# EAGLE design plytka_glowna (EAGLE 7.6.0)
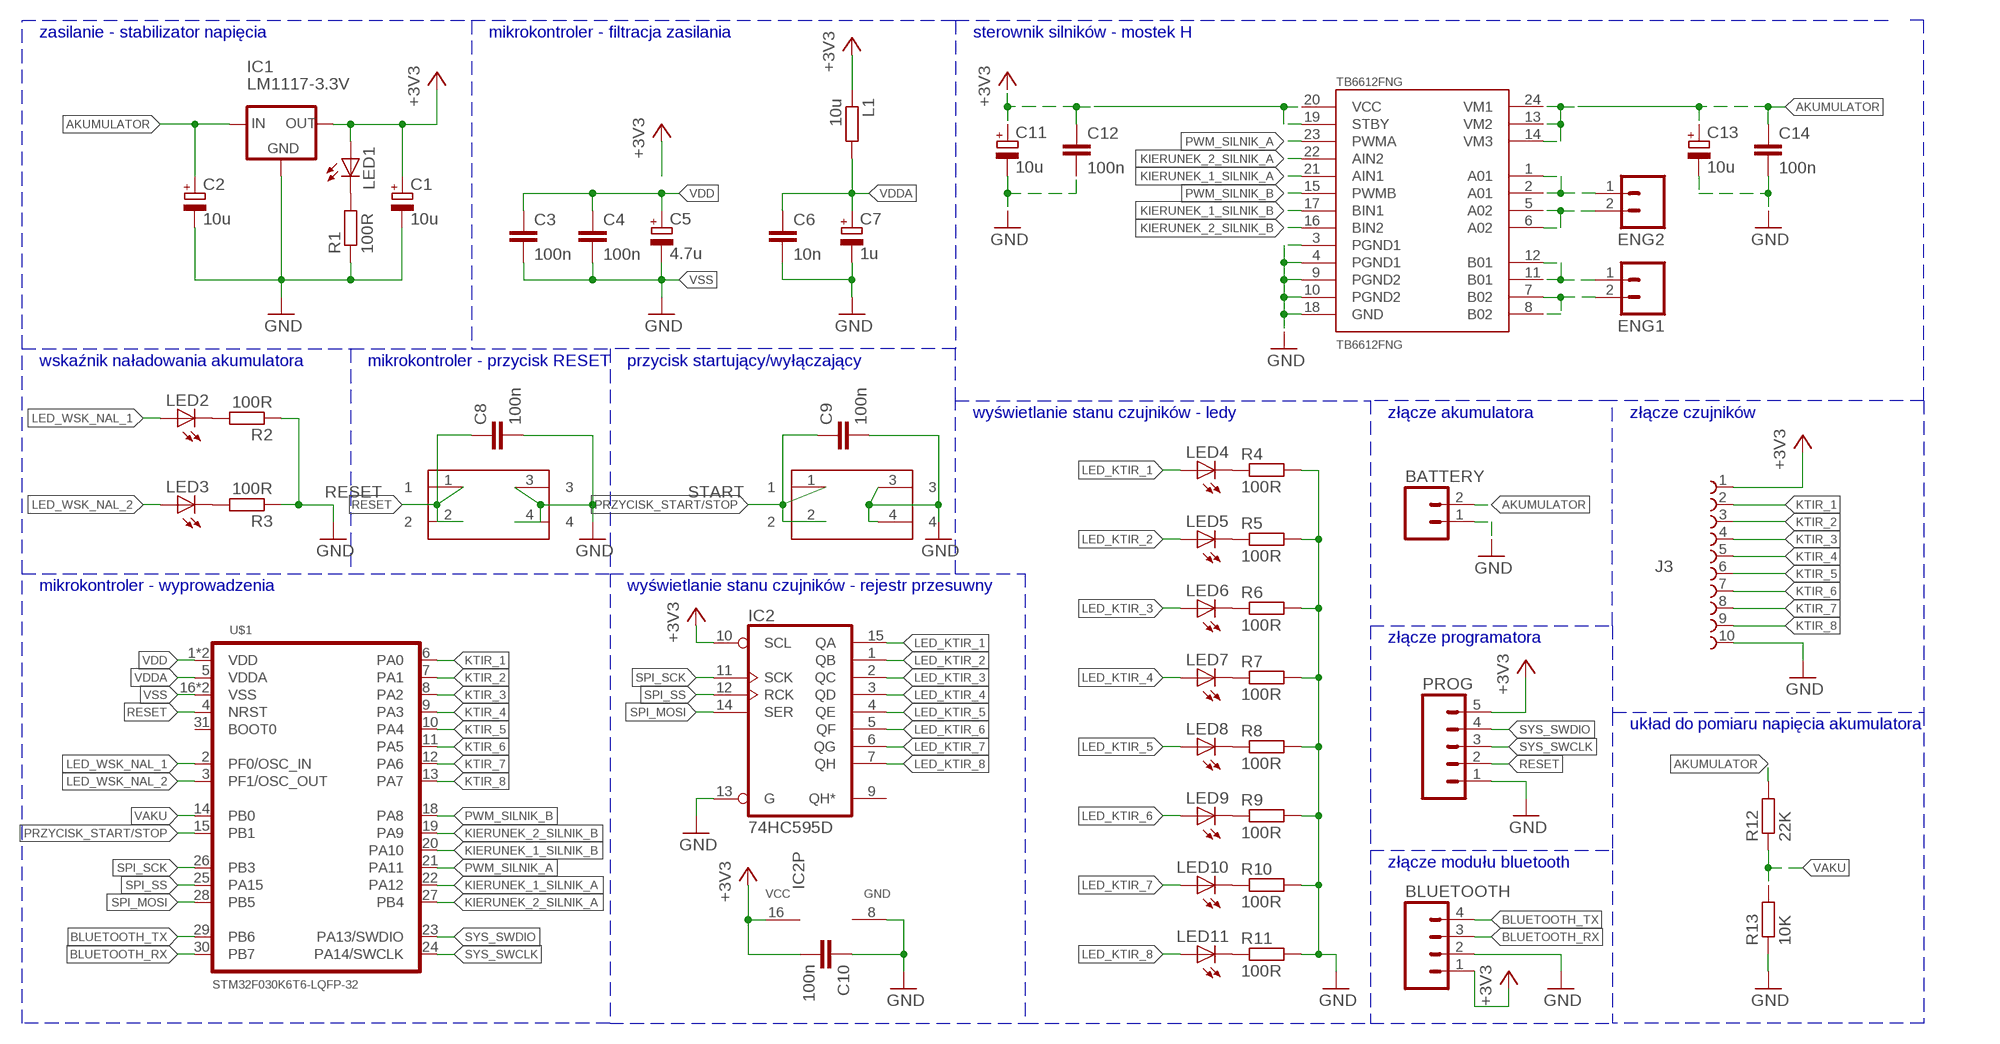
[diagram p0: schematic, sheet 1]

## Parts
BATTERY  M02-JST-2-PTH-NO_SILK  [JST-2-PTH-NS]
BLUETOOTH  M04JST  [1X04-1.5MM_JST]
C1  10u  CPOL-EUUD-4X5,8  [UD-4X5,8_NICHICON]
C2  10u  CPOL-EUUD-4X5,8  [UD-4X5,8_NICHICON]
C3  100n  C-EUC0805  [C0805]
C4  100n  C-EUC0805  [C0805]
C5  4.7u  CPOL-EUSMCA  [SMC_A]
C6  10n  C-EUC0805  [C0805]
C7  1u  CPOL-EUSMCA  [SMC_A]
C8  100n  C-EUC0805  [C0805]
C9  100n  C-EUC0805  [C0805]
C10  100n  C-EUC0805  [C0805]
C11  10u  CPOL-EUUD-4X5,8  [UD-4X5,8_NICHICON]
C12  100n  C-EUC0805  [C0805]
C13  10u  CPOL-EUUD-4X5,8  [UD-4X5,8_NICHICON]
C14  100n  C-EUC0805  [C0805]
ENG1  M02-JST-2-PTH-NO_SILK  [JST-2-PTH-NS]
ENG2  M02-JST-2-PTH-NO_SILK  [JST-2-PTH-NS]
IC1  LM1117-3.3V  LM1117DTX-3.3  [TO252]
IC2  74HC595D  [SO16]
J3  68611014422  [68611014422]
L1  10u  R-EU_R0805  [R0805]
LED1  LEDCHIP-LED0805  [CHIP-LED0805]
LED2  LEDCHIP-LED0805  [CHIP-LED0805]
LED3  LEDCHIP-LED0805  [CHIP-LED0805]
LED4  LEDCHIP-LED0805  [CHIP-LED0805]
LED5  LEDCHIP-LED0805  [CHIP-LED0805]
LED6  LEDCHIP-LED0805  [CHIP-LED0805]
LED7  LEDCHIP-LED0805  [CHIP-LED0805]
LED8  LEDCHIP-LED0805  [CHIP-LED0805]
LED9  LEDCHIP-LED0805  [CHIP-LED0805]
LED10  LEDCHIP-LED0805  [CHIP-LED0805]
LED11  LEDCHIP-LED0805  [CHIP-LED0805]
PROG  M05LOCK_LONGPADS  [1X05_LOCK_LONGPADS]
R1  100R  R-EU_M0805  [M0805]
R2  100R  R-EU_M0805  [M0805]
R3  100R  R-EU_M0805  [M0805]
R4  100R  R-EU_M0805  [M0805]
R5  100R  R-EU_M0805  [M0805]
R6  100R  R-EU_M0805  [M0805]
R7  100R  R-EU_M0805  [M0805]
R8  100R  R-EU_M0805  [M0805]
R9  100R  R-EU_M0805  [M0805]
R10  100R  R-EU_M0805  [M0805]
R11  100R  R-EU_M0805  [M0805]
R12  22K  R-EU_M0805  [M0805]
R13  10K  R-EU_M0805  [M0805]
RESET  430186043916  [430186043916]
START  430186043916  [430186043916]
TB6612FNG  TB6612FNG  [SSOP24]
U$1  STM32F030K6T6-LQFP-32  [LQFP-32]

## Nets
+3V3: BLUETOOTH.1 C1.+ C10.2 IC1.TAB(OUT) IC2.10(SCL) IC2.16(VCC) J3.1 L1.1 LED1.A PROG.5
AKUMULATOR: BATTERY.2 C2.+ C13.+ C14.1 IC1.2(IN) R12.2 TB6612FNG.13(VM2) TB6612FNG.14(VM3) TB6612FNG.24(VM1)
BLUETOOTH_RX: BLUETOOTH.3 U$1.30(PB7)
BLUETOOTH_TX: BLUETOOTH.4 U$1.29(PB6)
GND: BATTERY.1 BLUETOOTH.2 C1.- C2.- C6.2 C7.- C8.2 C9.2 C10.1 C11.- C12.2 C13.- C14.2 IC1.1(GND) IC2.8(GND) IC2.13(G) J3.10 PROG.1 R1.1 R2.1 R3.1 R4.2 R5.2 R6.2 R7.2 R8.2 R9.2 R10.2 R11.2 R13.1 RESET.3 RESET.4 START.3 START.4 TB6612FNG.3(PGND1) TB6612FNG.4(PGND1) TB6612FNG.9(PGND2) TB6612FNG.10(PGND2) TB6612FNG.18(GND)
KIERUNEK_1_SILNIK_A: TB6612FNG.21(AIN1) U$1.22(PA12)
KIERUNEK_1_SILNIK_B: TB6612FNG.17(BIN1) U$1.20(PA10)
KIERUNEK_2_SILNIK_A: TB6612FNG.22(AIN2) U$1.27(PB4)
KIERUNEK_2_SILNIK_B: TB6612FNG.16(BIN2) U$1.19(PA9)
KTIR_1: J3.2 U$1.6(PA0)
KTIR_2: J3.3 U$1.7(PA1)
KTIR_3: J3.4 U$1.8(PA2)
KTIR_4: J3.5 U$1.9(PA3)
KTIR_5: J3.6 U$1.10(PA4)
KTIR_6: J3.7 U$1.11(PA5)
KTIR_7: J3.8 U$1.12(PA6)
KTIR_8: J3.9 U$1.13(PA7)
LED_KTIR_1: IC2.15(QA) LED4.A
LED_KTIR_2: IC2.1(QB) LED5.A
LED_KTIR_3: IC2.2(QC) LED6.A
LED_KTIR_4: IC2.3(QD) LED7.A
LED_KTIR_5: IC2.4(QE) LED8.A
LED_KTIR_6: IC2.5(QF) LED9.A
LED_KTIR_7: IC2.6(QG) LED10.A
LED_KTIR_8: IC2.7(QH) LED11.A
LED_WSK_NAL_1: LED2.A U$1.2(PF0/OSC_IN)
LED_WSK_NAL_2: LED3.A U$1.3(PF1/OSC_OUT)
N$1: LED1.C R1.2
N$2: LED2.C R2.2
N$3: LED3.C R3.2
N$4: LED4.C R4.1
N$5: LED5.C R5.1
N$6: ENG2.2 TB6612FNG.5(A02) TB6612FNG.6(A02)
N$7: ENG1.2 TB6612FNG.7(B02) TB6612FNG.8(B02)
N$8: LED6.C R6.1
N$9: ENG1.1 TB6612FNG.11(B01) TB6612FNG.12(B01)
N$10: LED7.C R7.1
N$11: ENG2.1 TB6612FNG.1(A01) TB6612FNG.2(A01)
N$12: LED8.C R8.1
N$14: LED9.C R9.1
N$16: LED10.C R10.1
N$18: LED11.C R11.1
PRZYCISK_START/STOP: C9.1 START.1 START.2 U$1.15(PB1)
PWM_SILNIK_A: TB6612FNG.23(PWMA) U$1.21(PA11)
PWM_SILNIK_B: TB6612FNG.15(PWMB) U$1.18(PA8)
RESET: C8.1 PROG.2 RESET.1 RESET.2 U$1.4(NRST)
SPI_MOSI: IC2.14(SER) U$1.28(PB5)
SPI_SCK: IC2.11(SCK) U$1.26(PB3)
SPI_SS: IC2.12(RCK) U$1.25(PA15)
SYS_SWCLK: PROG.3 U$1.24(PA14/SWCLK)
SYS_SWDIO: PROG.4 U$1.23(PA13/SWDIO)
TB6612_VCC: C11.+ C12.1 TB6612FNG.19(STBY) TB6612FNG.20(VCC) ; supply symbol labelled +3V3
VAKU: R12.1 R13.2 U$1.14(PB0)
VDD: C3.1 C4.1 C5.+ U$1.1(VDD) U$1.17(VDD)
VDDA: C6.1 C7.+ L1.2 U$1.5(VDDA)
VSS: C3.2 C4.2 C5.- U$1.16(VSS) U$1.32(VSS) ; supply symbol labelled GND
Unconnected: IC2.9(QH*) U$1.31(BOOT0)

## Buses
B$1

## Notes on the sheet
- zasilanie - stabilizator napięcia | mikrokontroler - filtracja zasilania | sterownik silników - mostek H
- wskaźnik naładowania akumulatora | mikrokontroler - przycisk RESET | przycisk startujący/wyłączający
- wyświetlanie stanu czujników - ledy | złącze akumulatora | złącze czujników
- mikrokontroler - wyprowadzenia | wyświetlanie stanu czujników - rejestr przesuwny
- złącze programatora
- układ do pomiaru napięcia akumulatora
- złącze modułu bluetooth

## Library data of the parts
BATTERY ENG1 ENG2 = SparkFun-Connectors:M02: Standard 2-pin 0.1" header. Use with - straight break away headers ( PRT-00116) - right angle break away headers (PRT-00553) - swiss pins (PRT-00743) - machine pins (PRT-00117) - female headers (PRT-00115) Molex polarized connector foot print use with: PRT-08233 with associated crimp pins and housings. 2.54_SCREWTERM for use with PRT-10571. 3.5mm Screw Terminal footprints for PRT-08084 5mm Screw Terminal footprints for use with PRT-08432
BLUETOOTH = SparkFun-Connectors:M04: Header 4 Standard 4-pin 0.1" header. Use with straight break away headers (SKU : PRT-00116), right angle break away headers (PRT-00553), swiss pins (PRT-00743), machine pins (PRT-00117), and female headers (PRT-00115). Molex polarized connector foot print use with SKU : PRT-08231 with associated crimp pins and housings. 1MM SMD Version SKU: PRT-10208; PROD_ID: CONN-12477
C1 C2 C5 C7 C11 C13 = rcl:CPOL-EU: POLARIZED CAPACITOR, European symbol
C3 C4 C6 C8-C10 C12 C14 = rcl:C-EU: CAPACITOR, European symbol
IC1 = lm1117:LM1117DTX-*
IC2 = 74xx-eu:74*595: 8-bit SHIFT REGISTER, output latch
J3 = FPC_Connectors_Flat_Flexible_Cable_rev15c:68611014422: WR-FPC 1.00mm SMT ZIF Horizontal Bottom Contact, 10 Pins=>Code : Con_FPC_ZIF_1.00_68611014422 <http://katalog.we-online.de/media/images/eican/Con_FPC_ZIF_1.00_6861xx14422_pf2.jpg> Details see: http://katalog.we-online.de/en/em/686_1xx_144_22 Created 2014-07-09, Karrer Zheng 2014 (C) Würth Elektronik
L1 R1-R13 = rcl:R-EU_: RESISTOR, European symbol
LED1-LED11 = led:LED: LED OSRAM: - CHIPLED LG R971, LG N971, LY N971, LG Q971, LY Q971, LO R971, LY R971 LH N974, LH R974 LS Q976, LO Q976, LY Q976 LO Q996 - Hyper CHIPLED LW Q18S LB Q993, LB Q99A, LB R99A - SideLED LS A670, LO A670, LY A670, LG A670, LP A670 LB A673, LV A673, LT A673, LW A673 LH A674 LY A675 LS A676, LA A676, LO A676, LY A676, LW A676 LS A679, LY A679, LG A679 - Hyper Micro SIDELED® LS Y876, LA Y876, LO Y876, LY Y876 LT Y87S - SmartLED LW L88C, LW L88S LB L89C, LB L89S, LG L890 LS L89K, LO L89K, LY L89K LS L896, LA L896, LO L896, LY L896 - TOPLED LS T670, LO T670, LY T670, LG T670, LP T670 LSG T670, LSP T670, LSY T670, LOP T670, LYG T670 LG T671, LOG T671, LSG T671 LB T673, LV T673, LT T673, LW T673 LH T674 LS T676, LA T676, LO T676, LY T676, LB T676, LH T676, LSB T676, LW T676 LB T67C, LV T67C, LT T67C, LS T67K, LO T67K, LY T67K, LW E67C LS E67B, LA E67B, LO E67B, LY E67B, LB E67C, LV E67C, LT E67C LW T67C LS T679, LY T679, LG T679 LS T770, LO T770, LY T770, LG T770, LP T770 LB T773, LV T773, LT T773, LW T773 LH T774 LS E675, LA E675, LY E675, LS T675 LS T776, LA T776, LO T776, LY T776, LB T776 LHGB T686 LT T68C, LB T68C - Hyper Mini TOPLED® LB M676 - Mini TOPLED Santana® LG M470 LS M47K, LO M47K, LY M47K Source: http://www.osram.convergy.de LUXEON: - LUMILED® LXK2-PW12-R00, LXK2-PW12-S00, LXK2-PW14-U00, LXK2-PW14-V00 LXK2-PM12-R00, LXK2-PM12-S00, LXK2-PM14-U00 LXK2-PE12-Q00, LXK2-PE12-R00, LXK2-PE12-S00, LXK2-PE14-T00, LXK2-PE14-U00 LXK2-PB12-K00, LXK2-PB12-L00, LXK2-PB12-M00, LXK2-PB14-N00, LXK2-PB14-P00, LXK2-PB14-Q00 LXK2-PR12-L00, LXK2-PR12-M00, LXK2-PR14-Q00, LXK2-PR14-R00 LXK2-PD12-Q00, LXK2-PD12-R00, LXK2-PD12-S00 LXK2-PH12-R00, LXK2-PH12-S00 LXK2-PL12-P00, LXK2-PL12-Q00, LXK2-PL12-R00 Source: www.luxeon.com KINGBRIGHT: KA-3528ASYC Source: www.kingbright.com
PROG = SparkFun-Connectors:M05: Header 5 Standard 5-pin 0.1" header. Use with straight break away headers (SKU : PRT-00116), right angle break away headers (PRT-00553), swiss pins (PRT-00743), machine pins (PRT-00117), and female headers (PRT-00115). Molex polarized connector foot print use with SKU : PRT-08230 with associated crimp pins and housings.
RESET START = Switches_rev16a:430186043916: WS-TST-6x6 mm THT Tact Switch,4 pins
TB6612FNG = SparkFun-PowerIC:TB6612FNG: Toshiba 1A dual motor driver IC-09363; PROD_ID: IC-09363
U$1 = STM32F030K6T6:STM32F030K6T6

## Board
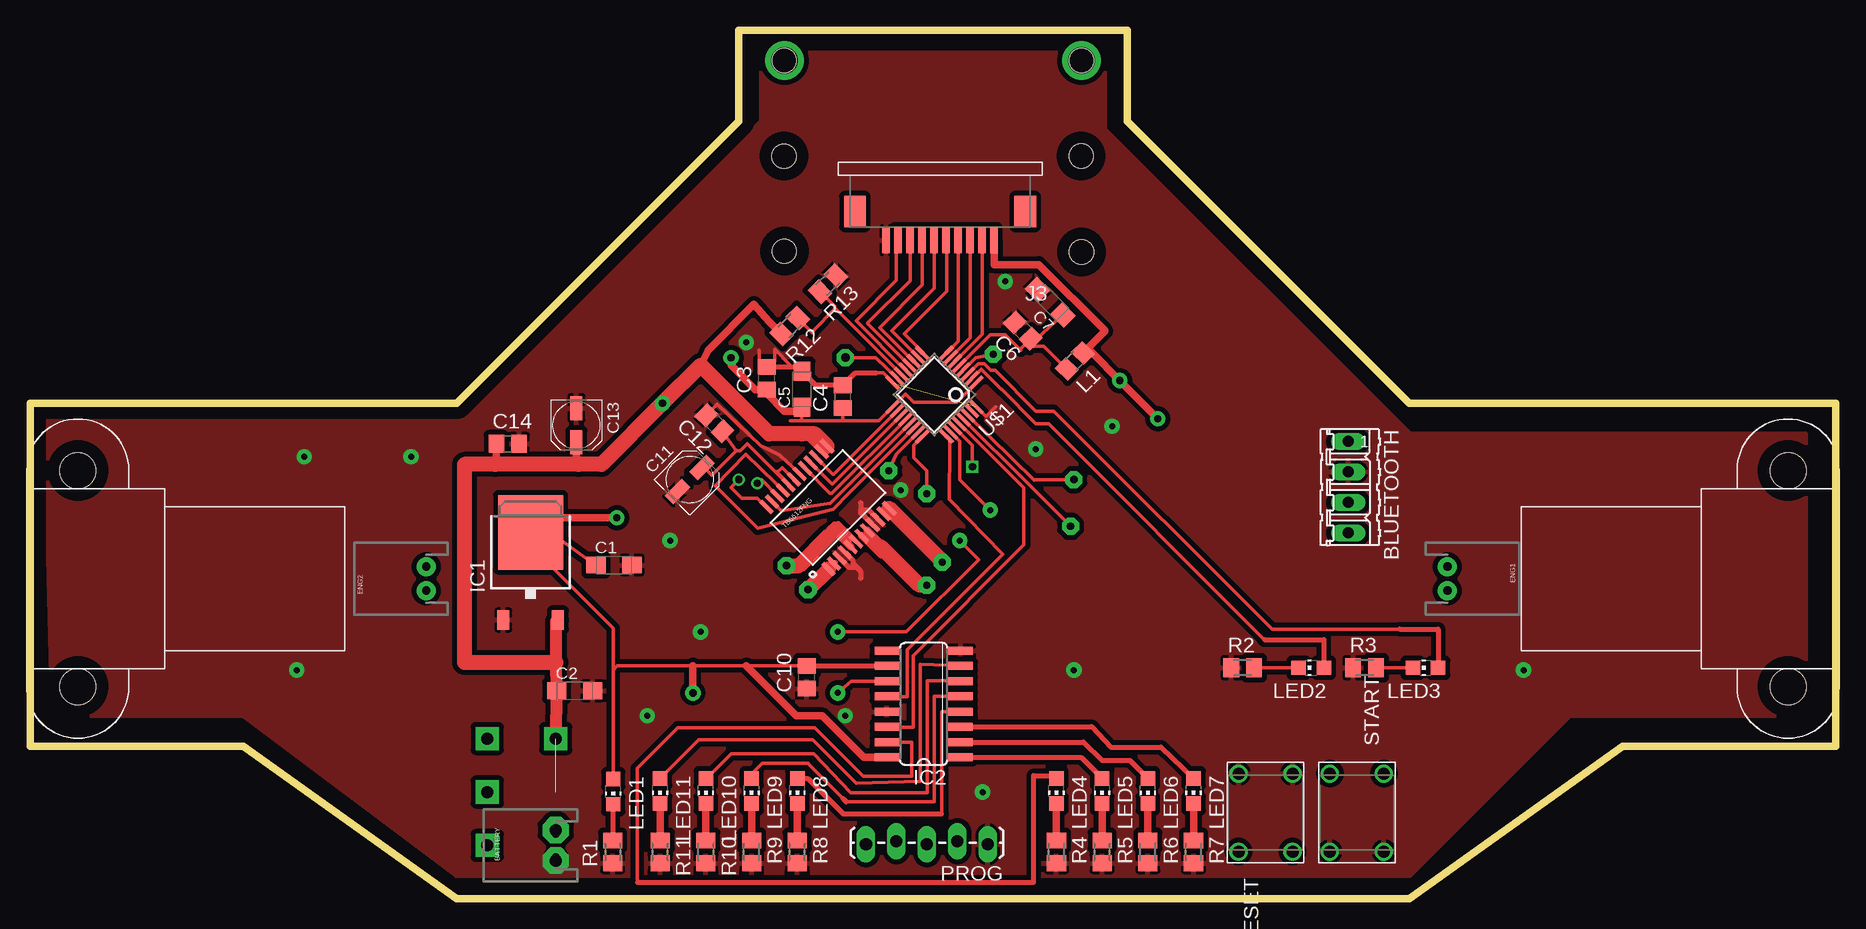
[diagram p1: board, top side]
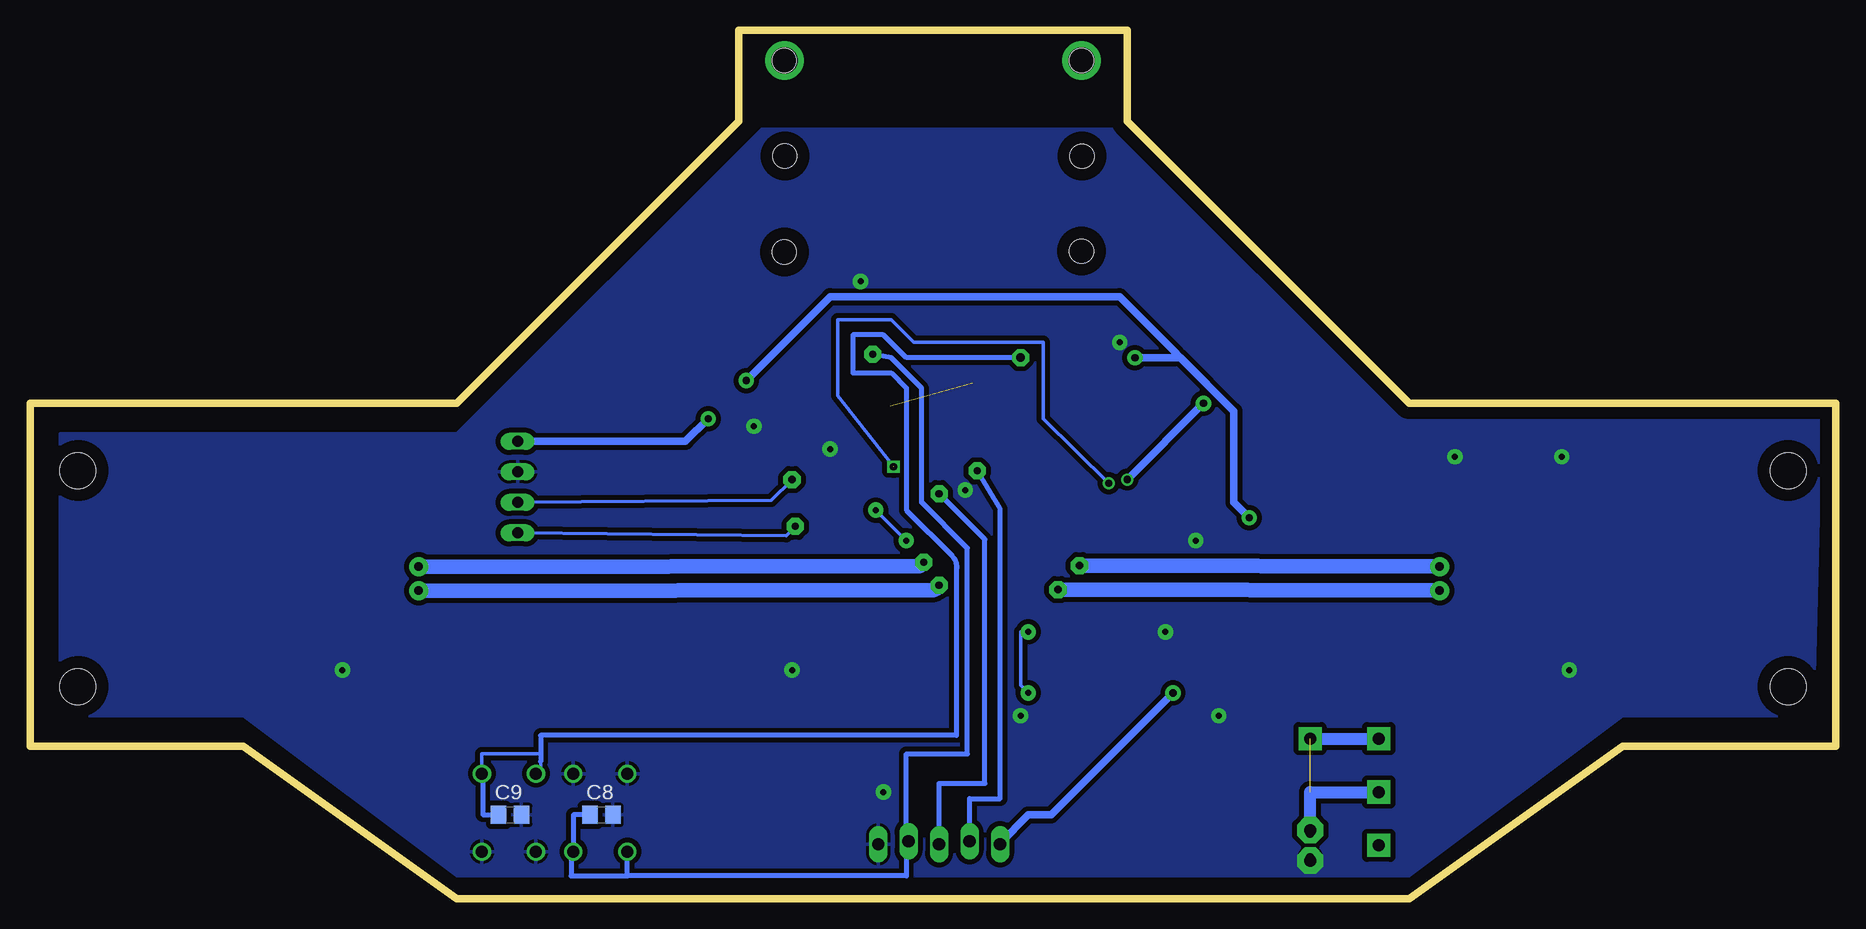
[diagram p2: board, bottom side, seen from below]

Size 150.5 x 72.39 mm. Coordinates in mm from the lower left corner, seen from the top.
Outline: 0,41.27 0,12.7 17.78,12.7 35.56,0 114.94,0 132.72,12.7 150.5,12.7 150.5,41.27 114.94,41.27 91.44,64.77 91.44,72.39 59.05,72.39 59.05,64.77 35.56,41.27 0,41.27
Copper layers (1*16): Top 0.035mm / dielectric 1.5mm / Bottom 0.035mm
Design rules "default": minimum track width 10mil, minimum drill 24mil, track to track 8mil, track to pad 8mil, pad to pad 8mil, via to via 8mil, smd to smd 8mil, copper to edge 40mil, drill to drill 8mil, minimum pad ring 10mil, minimum via ring 8mil, stop-mask expansion 4mil, vias tented up to drill 0mil, thermal gap 10mil
Holes 2 mm at 62.87,69.85 87.63,69.85 62.83,61.87 62.87,53.96 87.63,53.89 87.59,61.89

### Footprints (pad centres in the part's own frame; a part is rotated, then mirrored left to right if it is on the bottom)
JST-2-PTH-NS = drill 0.7 pad 1.6: 1 -1,0; 2 1,0
04P = drill 0.914 long: 1 -3.81,0; 2 -1.27,0; 3 1.27,0; 4 3.81,0
SMC_A = smd 1.6 x 1.4: + -1.5,0; - 1.5,0
C0805 = smd 1.3 x 1.5: 1 -0.95,0; 2 0.95,0
UD-4X5,8_NICHICON = smd 2 x 1: + 1.425,0; - -1.425,0
TO252 = smd 1 x 1.6: 1 -2.28,-4.8; 2 2.28,-4.8 | smd 5.4 x 6.2: TAB 0,2.5
SO16 = smd 0.66 x 2.032: 1 -4.445,-3.073; 2 -3.175,-3.073; 3 -1.905,-3.073; 4 -0.635,-3.073; 5 0.635,-3.073; 6 1.905,-3.073; 7 3.175,-3.073; 8 4.445,-3.073; 9 4.445,3.073; 10 3.175,3.073; 11 1.905,3.073; 12 0.635,3.073; 13 -0.635,3.073; 14 -1.905,3.073; 15 -3.175,3.073; 16 -4.445,3.073
68611014422 = smd 0.6 x 2.2: 1 -7.5,1.1; 2 -6.5,1.1; 3 -5.5,1.1; 4 -4.5,1.1; 5 -3.5,1.1; 6 -2.5,1.1; 7 -1.5,1.1; 8 -0.5,1.1; 9 0.5,1.1; 10 1.5,1.1 | smd 1.8 x 2.6: Z1 -10.1,-1.3; Z2 4.1,-1.3
R0805 = smd 1.3 x 1.5: 1 -0.95,0; 2 0.95,0
CHIP-LED0805 = smd 1.2 x 1.2: A 0,-1.05; C 0,1.05
1X05_LOCK_LONGPADS = drill 1.016 long: 1 0,0; 2 2.54,-0.254; 3 5.08,0; 4 7.62,-0.254; 5 10.16,0
M0805 = smd 1.3 x 1.6: 1 -0.95,0; 2 0.95,0
430186043916 = drill 1: 1 -3.25,2.25; 2 -3.25,-2.25; 3 3.25,2.25; 4 3.25,-2.25
SSOP24 = smd 0.348 x 1.397: 1 -3.575,-3.656; 2 -2.925,-3.656; 3 -2.275,-3.656; 4 -1.625,-3.656; 5 -0.975,-3.656; 6 -0.325,-3.656; 7 0.325,-3.656; 8 0.975,-3.656; 9 1.625,-3.656; 10 2.275,-3.656; 11 2.925,-3.656; 12 3.575,-3.656; 13 3.575,3.656; 14 2.925,3.656; 15 2.275,3.656; 16 1.625,3.656; 17 0.975,3.656; 18 0.325,3.656; 19 -0.325,3.656; 20 -0.975,3.656; 21 -1.625,3.656; 22 -2.275,3.656; 23 -2.925,3.656; 24 -3.575,3.656
LQFP-32 = smd 0.3 x 1.6: 1 -1.75,-3.1; 2 -1.25,-3.1; 3 -0.75,-3.1; 4 -0.25,-3.1; 5 0.25,-3.1; 6 0.75,-3.1; 7 1.25,-3.1; 8 1.75,-3.1; 17 1.75,3.1; 18 1.25,3.1; 19 0.75,3.1; 20 0.25,3.1; 21 -0.25,3.1; 22 -0.75,3.1; 23 -1.25,3.1; 24 -1.75,3.1 | smd 1.6 x 0.3: 9 3.1,-1.75; 10 3.1,-1.25; 11 3.1,-0.75; 12 3.1,-0.25; 13 3.1,0.25; 14 3.1,0.75; 15 3.1,1.25; 16 3.1,1.75; 25 -3.1,1.75; 26 -3.1,1.25; 27 -3.1,0.75; 28 -3.1,0.25; 29 -3.1,-0.25; 30 -3.1,-0.75; 31 -3.1,-1.25; 32 -3.1,-1.75
HP_NM = hole 3: -9,-3; 9,-3

### Placement (x,y rotation side)
BATTERY  43.81,4.45 90 top
BLUETOOTH  [04P]  109.86,34.29 270 top
C1  10u  [SMC_A]  48.67,27.8 0 top
C2  10u  [SMC_A]  45.4,17.32 0 top
C3  61.4,43.37 90 top
C4  67.75,41.84 90 top
C5  64.33,42.46 90 top
C6  82.73,47.34 135 top
C7  85.02,49.7 135 top
C8  102.87,6.99 0 bottom
C9  110.49,6.99 0 bottom
C10  64.73,18.45 90 top
C11  54.98,34.92 45 top
C12  57.04,39.62 135 top
C13  45.53,39.46 270 top
C14  39.81,37.9 0 top
ENG1  118.11,26.67 270 top
ENG2  33.02,26.67 90 top
IC1  41.72,28.03 0 top
IC2  74.48,16.23 90 top
J3  72.83,55.97 180 top
L1  87.07,44.8 225 top
LED1  48.6,8.92 180 top
LED2  106.77,19.24 90 top
LED3  116.29,19.24 90 top
LED4  85.53,8.98 180 top
LED5  89.34,8.98 180 top
LED6  93.15,8.98 180 top
LED7  96.96,8.98 180 top
LED8  63.94,8.98 180 top
LED9  60.13,8.98 180 top
LED10  56.32,8.98 180 top
LED11  52.51,8.98 180 top
PROG  79.82,4.53 180 top
R1  48.55,3.9 90 top
R2  101.05,19.24 0 top
R3  111.21,19.24 0 top
R4  85.53,3.9 270 top
R5  89.34,3.9 270 top
R6  93.15,3.9 270 top
R7  96.96,3.9 270 top
R8  63.94,3.9 270 top
R9  60.13,3.9 270 top
R10  56.32,3.9 270 top
R11  52.51,3.9 270 top
R12  63.31,47.71 225 top
R13  66.49,51.25 225 top
RESET  102.96,7.18 90 top
START  110.58,7.18 270 top
TB6612FNG  66.48,32.58 45 top
U$1  75.37,42 135 top
U$3  [HP_NM]  143.51,26.67 90 top
U$4  [HP_NM]  6.99,26.67 270 top

### Tracks (layer width: path | path; a pad name or v marks a point on that pad's centre or on a via)
+3V3  (via drill 0.6 pad 1.27)
  Top 0.305: IC1.TAB 41.72,29.84 | 41.72,29.84 41.72,29.4 48.6,22.52 48.6,19.05 | LED1.A 48.6,19.05 | C1.+ 42.8,30.92 41.72,29.84 | C10.2 59.69,19.4 55.24,19.4 48.96,19.4 48.6,19.05
  Top 0.406: C10.2 68.34,19.4 IC2.10
  Top 0.61: J3.1 80.33,52.85 80.34,52.84 84.06,52.84 89.55,47.36 89.55,47.28 88.12,45.86 | 88.12,45.86 L1.1 88.51,45.47 | v93.98,40.01 v90.81,43.18 88.51,45.47 | 88.51,45.47 88.12,45.86 | v55.24,17.14 55.24,19.4 | IC2.16 69.5,11.78 66.04,15.24 63.85,15.24 59.69,19.4 | v48.9,31.75 43.62,31.75 42.8,30.92
  Bottom 0.61: BLUETOOTH.1 95.89,38.1 v93.98,40.01 | PROG.5 69.66,4.64 67.31,6.99 65.41,6.99 v55.24,17.14 | v90.81,43.18 83.82,50.16 59.69,50.16 50.16,40.64 50.16,33.02 v48.9,31.75
AKUMULATOR  (via drill 0.6 pad 0.61, 0.6 pad 1.27, 1 pad 1.93, 1 pad 2.18)  (1 unrouted)
  Top 0.305: TB6612FNG.24 61.34,32.64 60.6,33.38 59.31,33.38 58.43,34.25 58.43,34.3 v59.05,34.92 | TB6612FNG.14 65.84,37.24 64.34,38.73
  Top 0.61: 43.85,13.37 v43.81,13.34 | C14.1 38.86,36.32 38.73,36.2 | C13.+ 45.53,36.39 45.72,36.2 | 55.88,44.45 56.52,45.72 60.33,49.53 61.59,48.09 R12.2
  Top 1.016: 43.85,13.37 C2.+ 43.85,19.68 43.85,23.08 IC1.2
  Top 1.27: TB6612FNG.13 66.43,37.71 65.41,38.73 64.34,38.73 61.59,38.73 55.88,44.45 v52.7,41.27 47.62,36.2 45.72,36.2 38.73,36.2 36.2,36.2 36.2,19.68 43.85,19.68
  Bottom 0.61: BATTERY.2 v43.81,5.71 | v59.05,34.92 v52.7,41.27
  Bottom 1.016: v43.81,5.71 43.81,8.89 38.1,8.89 | v43.81,13.34 38.1,13.34
BLUETOOTH_RX  (via drill 0.6 pad 1.42)
  Top 0.305: U$1.30 83.69,34.86 83.76,34.92 v87,34.92
  Bottom 0.305: v87,34.92 88.72,33.2 BLUETOOTH.3
BLUETOOTH_TX  (via drill 0.6 pad 1.42)
  Top 0.305: U$1.29 83.11,34.67 v86.72,31.03
  Bottom 0.305: v86.72,31.03 87.5,30.25 BLUETOOTH.4
GND  (via drill 0.5 pad 1.27, 1 pad 2.18)
  Top 0.305: TB6612FNG.18 62.45,36.99 60.91,37.76 57.26,41.19 C12.2 | 78.78,41.05 78.8,41.05 79.65,40.2 79.69,40.2 80.48,40.98 | 64.03,44.37 63.45,44.37 62.05,45.77 62.05,44.78 62.06,44.77 60.78,44.77 60.77,44.76 60.77,45.67 60.74,45.7
  Top 0.406: TB6612FNG.10 69.9,32.38 69.22,32.38 | 69.22,32.38 69.22,32.15 TB6612FNG.9 | 69.22,33.02 69.22,32.38 | TB6612FNG.4 68.58,28.19 68.58,27.94 68.9,27.62 | 68.9,27.62 69.22,27.3 69.22,26.67 | TB6612FNG.3 68.23,27.62 68.9,27.62
  other vias: 43.81,3.17 22.86,36.83 31.75,36.83 22.23,19.05 51.44,15.24 79.38,8.89 87,19.05 55.88,22.23 53.34,29.84 59.69,46.35 90.17,39.37 81.28,51.44 124.46,19.05 72.56,34.05 83.82,37.47 67.94,15.24
  pour Top (isolate 0.406): 1.27,40.01 35.56,40.01 36.2,40.01 60.96,64.77 60.96,70.48 89.53,70.48 89.53,64.77 89.53,64.14 114.94,38.73 147.96,38.73 147.96,15.24 128.27,15.24 114.94,1.91 35.56,1.91 17.78,15.24 2.54,15.24 1.91,15.24
  pour Bottom (isolate 0.406): 60.33,64.14 89.53,64.14 114.94,38.73 147.96,38.73 147.96,15.24 132.72,15.24 114.94,1.91 35.56,1.91 17.78,15.24 1.91,15.24 1.27,40.01 36.2,40.01
KIERUNEK_1_SILNIK_A
  Top 0.305: U$1.22 68.33,33.88 68.31,33.88 66.94,32.45 60.66,30.89 57.11,34.43 59.66,37.02 62.17,34.63 62.75,34.05 TB6612FNG.21
KIERUNEK_1_SILNIK_B
  Top 0.305: U$1.20 66.83,33.8 66.65,33.8 TB6612FNG.17
KIERUNEK_2_SILNIK_A  (via drill 0.6, 0.6 pad 0.61)  (1 unrouted)
  Top 0.305: TB6612FNG.22 60.96,34.92 v60.6,34.61 | v78.52,35.99 78.51,37.06 78.51,37.8 U$1.27
  Bottom 0.305: v60.6,34.61 66.04,40.01 66.04,46.35 76.83,46.35 78.74,48.26 83.19,48.26 83.19,41.91 v78.52,35.99
  other vias: 78.54,36
KIERUNEK_2_SILNIK_B
  Top 0.305: U$1.19 72.65,40.32 66.9,34.57 66.8,34.57 TB6612FNG.16
KTIR_1
  Top 0.305: J3.2 79.33,47.02 U$1.6
KTIR_2
  Top 0.305: J3.3 78.33,46.73 U$1.7
KTIR_3
  Top 0.305: J3.4 77.33,46.43 U$1.8
KTIR_4
  Top 0.305: U$1.9 74.42,45.49 72.83,47.08 76.39,50.63 76.39,54.81 J3.5
KTIR_5
  Top 0.305: U$1.10 74.07,45.09 71.82,47.33 75.37,50.89 75.37,54.83 J3.6
KTIR_6
  Top 0.305: U$1.11 73.67,44.72 70.8,47.59 74.36,51.14 74.36,54.84 J3.7
KTIR_7
  Top 0.305: U$1.12 73.36,44.38 69.83,47.92 69.83,47.98 73.36,51.51 73.36,54.85 J3.8
KTIR_8
  Top 0.305: U$1.13 72.98,44.01 68.85,48.15 68.85,48.17 72.2,51.52 72.2,54.73 J3.9
LED_KTIR_1
  Top 0.305: IC2.15 73.47,13.05 73.47,10.21 69.46,10.21 65.41,14.26 53.98,14.26 50.6,10.88 50.6,1.56 50.8,1.36
  Top 0.406: 50.61,1.36 50.8,1.36 83.63,1.36 83.63,10.25 85.53,10.25 LED4.A
LED_KTIR_2
  Top 0.406: IC2.1 87.59,11.78 LED5.A
LED_KTIR_3
  Top 0.406: IC2.2 87.81,13.05 89.34,11.52 91.67,11.52 LED6.A
LED_KTIR_4
  Top 0.406: IC2.3 88.46,14.34 90.04,12.64 94.25,12.62 LED7.A
LED_KTIR_5
  Top 0.305: IC2.4 75.97,15.58 75.97,7.07
  Top 0.406: LED8.A 64.8,10.03 67.75,7.07 75.97,7.07 | IC2.4
LED_KTIR_6
  Top 0.305: 60.13,10.27 60.13,10.43 61.01,11.3 64.85,11.3 64.87,11.28 64.87,11.23 67.75,8.34 | 68.01,8.08 75.36,8.08 75.36,16.87 IC2.5
  Top 0.406: LED9.A 60.13,10.27 | 67.75,8.34 67.75,8.33 68.01,8.08 | 77.55,16.89 IC2.5
LED_KTIR_7
  Top 0.305: LED10.A 56.38,10.03 58.42,12.06 65.32,12.06 68.4,8.83 74.78,8.83 74.78,18.15 77.55,18.15 IC2.6
LED_KTIR_8
  Top 0.305: IC2.7 74.18,19.55 74.18,9.77 68.87,9.61 65.24,13.25 55.73,13.25 LED11.A
LED_WSK_NAL_1
  Top 0.305: U$1.2 79.27,44.12 80.95,42.44 80.96,42.44 83.83,39.57 84.89,39.57 102.87,21.59
  Top 0.406: 102.87,21.59 107.82,21.59 LED2.A
LED_WSK_NAL_2
  Top 0.305: U$1.3 79.02,44.58 79.52,44.58 80.06,44.03 80.43,44.03 83.82,40.64 85.32,40.64 103.5,22.45 114.13,22.45
  Top 0.406: 114.13,22.45 117.34,22.45 LED3.A
N$1
  Top 0.406: LED1.C 48.55,7.87 R1.2
N$2
  Top 0.305: R2.2 LED2.C
N$3
  Top 0.305: R3.2 LED3.C
N$4
  Top 0.61: R4.1 LED4.C
N$5
  Top 0.61: R5.1 LED5.C
N$6  (via drill 0.6 pad 1.42)
  Top 0.406: 66.65,30.32 66.9,30.57 67.12,30.57 67.32,30.77 67.32,31.27 68.82,29.77 TB6612FNG.6
  Top 0.61: TB6612FNG.5 67.12,30.57
  Top 1.27: v63.04,27.76 64.09,27.76 66.65,30.32
  Bottom 1.27: ENG2.2 v63.04,27.76
N$7  (via drill 0.6 pad 1.42)
  Top 0.61: 70.93,29.3 70.93,29.52 TB6612FNG.8 | TB6612FNG.7 69.37,30.23 70.93,28.66 71.25,28.98
  Top 1.27: v74.74,26.12 74.11,26.12 71.25,28.98 70.93,29.3
  Bottom 1.27: ENG1.2 75.11,25.76 v74.74,26.12
N$8
  Top 0.61: R6.1 LED6.C
N$9  (via drill 0.6 pad 1.42)
  Top 0.305: TB6612FNG.11 TB6612FNG.12
  Top 1.27: v76.01,28.03 76.01,28.11 TB6612FNG.12
  Bottom 1.27: ENG1.1 76.28,27.76 v76.01,28.03
N$10
  Top 0.61: R7.1 LED7.C
N$11  (via drill 0.6 pad 1.42)
  Top 0.406: TB6612FNG.2 67.02,27.93 67.12,28.03 67.1,28.03 TB6612FNG.1
  Top 1.27: v64.83,25.76 TB6612FNG.1
  Bottom 1.27: ENG2.1 v64.83,25.76
N$12
  Top 0.61: R8.1 LED8.C
N$13
  Top 0.406: 68.39,29.93 68.31,29.93 67.45,30.8
N$14
  Top 0.61: R9.1 LED9.C
N$15
  Top 0.406: 67.12,31.2 67,31.2 66.53,30.73 66.65,30.73 67.12,31.2
N$16
  Top 0.61: R10.1 LED10.C
N$17  (via drill 1 pad 1.93)
  other vias: 38.1,8.89
N$18
  Top 0.61: R11.1 LED11.C
N$19  (via drill 1 pad 1.93)
  other vias: 38.1,13.34
N$20  (via drill 1 pad 1.93)
  other vias: 38.1,4.45
N$24  (via drill 2.2 pad 1.27)
  other vias: 62.87,69.85
N$27  (via drill 2.2 pad 1.27)
  other vias: 87.63,69.85
PRZYCISK_START/STOP  (via drill 0.7 pad 1.42)
  Top 0.305: U$1.15 70.48,45.09 v67.94,45.09
  Bottom 0.305: START.1 112.83,12.06 107.95,12.06 107.95,11.43 107.95,10.43 START.2
  Bottom 0.406: v67.94,45.09 77.47,45.09 79.38,46.99 81.92,46.99 81.92,43.81 78.74,43.81 77.47,42.55 77.47,32.38 73.66,28.57 arc53 73.29,27.47 73.29,13.61 107.95,13.61 107.95,11.43 | START.1 112.76,10.43 112.76,7.01 111.44,7.01 C9.1
PWM_SILNIK_A
  Top 0.305: U$1.21 66.7,32.97 62.6,32.33 TB6612FNG.23
PWM_SILNIK_B
  Top 0.305: U$1.18 66.99,35.38 66.9,35.38 TB6612FNG.15
RESET  (via drill 0.6 pad 1.42)
  Top 0.305: v80.28,45.36 78.81,45.09 U$1.4
  Bottom 0.406: 77.47,4.79 77.47,1.91 100.71,1.91 | 100.71,1.91 RESET.1 | 100.71,1.91 105.41,1.91 105.41,3.92 RESET.2 105.21,6.99 C8.1 | PROG.2 77.47,4.79 | 77.47,4.79 77.47,12.06 72.39,12.06 72.39,29.21 76.2,33.02 76.2,42.55 78.74,45.09 v80.28,45.36
SPI_MOSI
  Top 0.305: IC2.14 71.42,14.3 73.61,14.3 73.58,14.33 73.58,20.26 82.8,29.48 82.8,34.25 77.43,39.63 U$1.28
SPI_SCK  (via drill 0.5 pad 1.27)
  Top 0.305: U$1.26 77.47,38.14 77.47,34.92 v80.01,32.38 | v77.47,29.84 78.74,28.57 79.07,28.23 73.03,22.23 v67.31,22.23 | v67.31,17.14 68.45,18.11 IC2.11
  Bottom 0.305: v80.01,32.38 v77.47,29.84 | v67.31,22.23 67.94,22.23 67.94,17.78 v67.31,17.14
SPI_SS
  Top 0.305: IC2.12 71.44,16.83 73.1,16.83 73.1,20.74 81.06,28.7 76.62,33.29 76.64,37.71 76.64,38.19 76.33,38.5 U$1.25
SYS_SWCLK  (via drill 0.6 pad 1.42)
  Top 0.305: v74.74,33.74 74.74,35.65 73.64,36.75 73.64,37.8 U$1.24
  Bottom 0.406: PROG.3 74.74,9.61 70.93,9.61 70.93,29.93 v74.74,33.74
SYS_SWDIO  (via drill 0.6 pad 1.42)
  Top 0.305: v71.56,35.65 72.2,37.06 U$1.23
  Bottom 0.406: PROG.4 72.2,8.34 69.66,8.34 69.66,32.47 v71.56,35.65
TB6612_VCC
  Top 0.305: 58.86,37.31 59.17,37.31 59.75,37.9 63.17,34.48 TB6612FNG.20 63.21,34.58 62.23,35.56 62.32,35.56 62.69,35.93 62.69,35.92 TB6612FNG.19 | 58.86,37.31 C12.1 | C11.+ 56.17,35.93 56.82,35.28 56.83,35.28 58.86,37.31
VAKU
  Top 0.305: U$1.14 67.12,49.19 | 67.12,49.19 67.04,49.26 67.04,49.35 R13.2 | R12.1 63.98,48.35 65.18,47.16 65.18,47.24 67.12,49.19
VDD  (via drill 0.6 pad 1.27)
  Top 0.305: U$1.1 77.24,41.38 73.64,41.38 72.96,42.05 72.95,42.05 U$1.17 70.71,39.81 67.94,39.81 | 67.94,39.81 64.14,39.81 | 64.14,39.81 63.37,39.81 | C5.+ 64.33,40.01 64.14,39.81 | C4.1 67.75,40.01 67.94,39.81
  Top 0.61: v58.42,45.09 58.42,44.45 60.45,42.42 C3.1 61.4,42.11 62.87,40.64 64.01,40.64 C5.+ | v48.9,31.75 43.81,31.75 41.27,29.21
  Bottom 0.61: v58.42,45.09 54.61,45.09 50.16,40.64 50.16,33.02 v48.9,31.75
VDDA
  Top 0.305: 83.22,46.03 C6.1 82.55,45.82 82.55,45.72 81.28,46.99 80.01,46.99 U$1.5 | 83.22,46.03 C7.+ | 83.22,46.03 84.49,46.03 L1.2
VSS  (1 unrouted)
  Top 0.305: 70.48,43.81 71.12,43.81 71.94,42.99 U$1.16
  Top 0.406: C3.2 63.96,44.32 C5.- 65.49,42.79 C4.2 68.77,43.81 70.48,43.81